# EAGLE design Rahul Gupta Breakout Board (EAGLE 9.6.2)
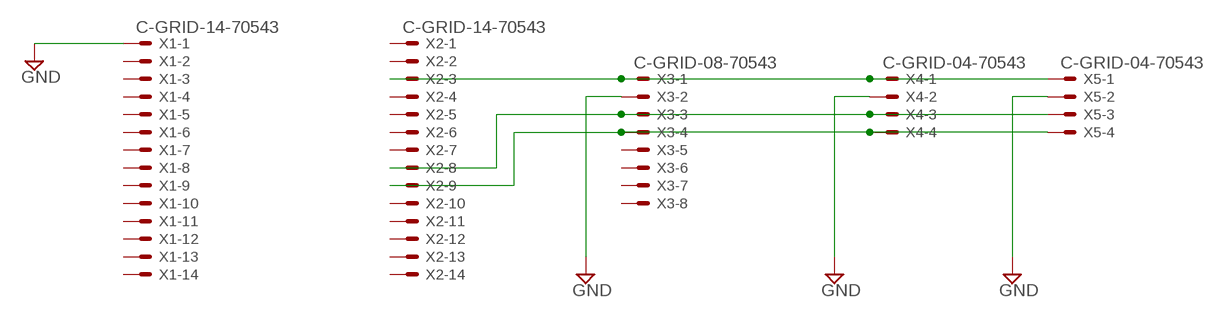
[diagram p0: schematic, sheet 1]

## Parts
X1  C-GRID-14-70543  [70543-14]
X2  C-GRID-14-70543  [70543-14]
X3  C-GRID-08-70543  [70543-08]
X4  C-GRID-04-70543  [70543-04]
X5  C-GRID-04-70543  [70543-04]

## Nets
GND: X1.1 X3.2 X4.2 X5.2
N$1: X2.3 X3.1 X4.1 X5.1
N$2: X2.8 X3.3 X4.3 X5.3
N$4: X2.9 X3.4 X4.4 X5.4
Unconnected: X1.2 X1.3 X1.4 X1.5 X1.6 X1.7 X1.8 X1.9 X1.10 X1.11 X1.12 X1.13 X1.14 X2.1 X2.2 X2.4 X2.5 X2.6 X2.7 X2.10 X2.11 X2.12 X2.13 X2.14 X3.5 X3.6 X3.7 X3.8

## Library data of the parts
X1 X2 = con-molex:C-GRID-14: CONNECTOR wire to board 2.54 mm (0.100") pitch header; MF: MOLEX; OC_FARNELL: unknown; OC_NEWARK: unknown
X3 = con-molex:C-GRID-08: CONNECTOR wire to board 2.54 mm (0.100") pitch header; MF: MOLEX; OC_FARNELL: unknown; OC_NEWARK: unknown
X4 X5 = con-molex:C-GRID-04: CONNECTOR wire to board 2.54 mm (0.100") pitch header; MF: MOLEX; OC_FARNELL: unknown; OC_NEWARK: unknown

## Board
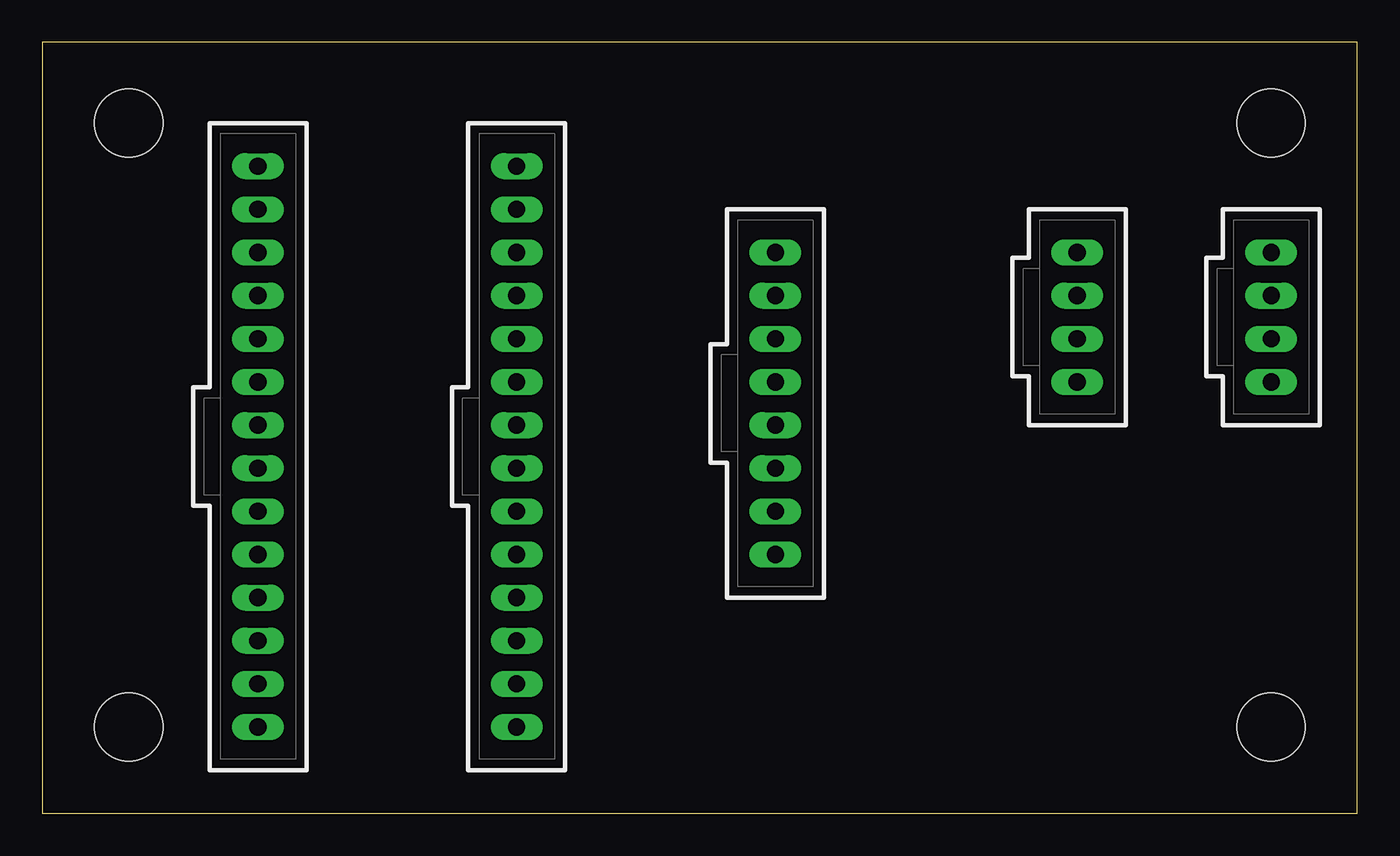
[diagram p1: board, top side]
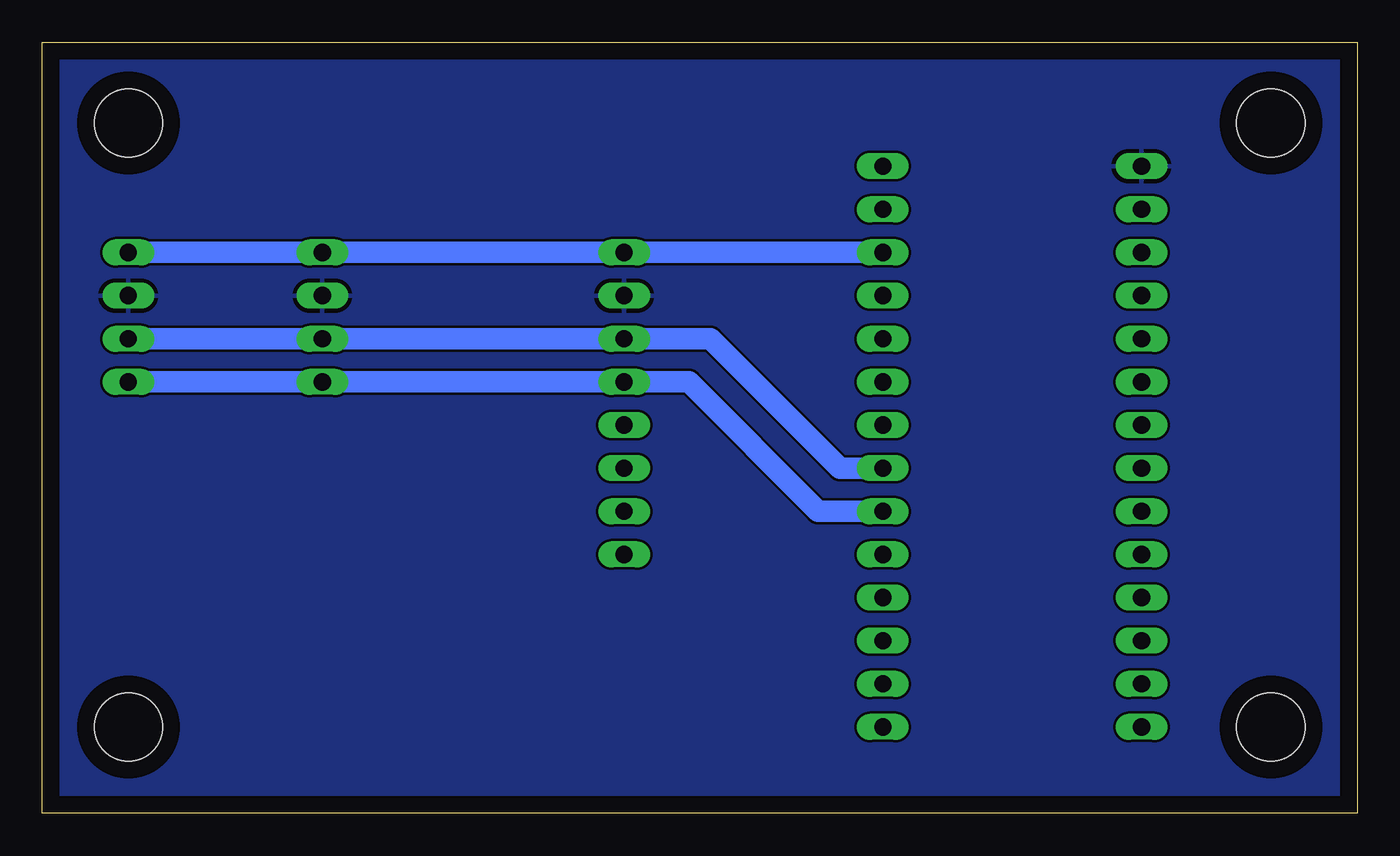
[diagram p2: board, bottom side, seen from below]

Size 77.45 x 45.39 mm. Coordinates in mm from the lower left corner, seen from the top.
Outline: 0,0 77.45,0 77.45,45.39 0,45.39 0,0
Copper layers (1*16): Top 0.035mm / dielectric 1.5mm / Bottom 0.035mm
Design rules "default": minimum track width 6mil, minimum drill 0.35mm, track to track 6mil, track to pad 6mil, pad to pad 6mil, via to via 6mil, smd to smd 6mil, copper to edge 40mil, drill to drill 6mil, minimum pad ring 10mil, minimum via ring 8mil, stop-mask expansion 4mil, vias tented up to drill 0mil, thermal gap 10mil
Holes 4 mm at 5.08,5.08 72.39,5.08 5.08,40.64 72.39,40.64

### Footprints (pad centres in the part's own frame; a part is rotated, then mirrored left to right if it is on the bottom)
70543-14 = drill 1.016 long: 1 -16.51,0; 2 -13.97,0; 3 -11.43,0; 4 -8.89,0; 5 -6.35,0; 6 -3.81,0; 7 -1.27,0; 8 1.27,0; 9 3.81,0; 10 6.35,0; 11 8.89,0; 12 11.43,0; 13 13.97,0; 14 16.51,0
70543-08 = drill 1.016 long: 1 -8.89,0; 2 -6.35,0; 3 -3.81,0; 4 -1.27,0; 5 1.27,0; 6 3.81,0; 7 6.35,0; 8 8.89,0
70543-04 = drill 1.016 long: 1 -3.81,0; 2 -1.27,0; 3 1.27,0; 4 3.81,0

### Placement (x,y rotation side)
X1  12.7,21.59 270 top
X2  27.94,21.59 270 top
X3  43.18,24.13 270 top
X4  60.96,29.21 270 top
X5  72.39,29.21 270 top

### Tracks (layer width: path | path; a pad name or v marks a point on that pad's centre or on a via)
GND
  pour Bottom: -1.27,46.99 78.74,46.99 78.74,-1.27 -1.27,-1.27
N$1
  Bottom 1.27: X2.3 X3.1 X4.1 X5.1
N$2
  Bottom 1.27: X5.3 X4.3 X3.3 38.1,27.94 30.48,20.32 X2.8
N$4
  Bottom 1.27: X5.4 X4.4 X3.4 39.37,25.4 31.75,17.78 X2.9

### Text on the board
Document: Teensie 4.0 | ITG/MPU | ACC | ACC / AUX